# Altium project PCB_Project_Perdolyot.PrjPcb
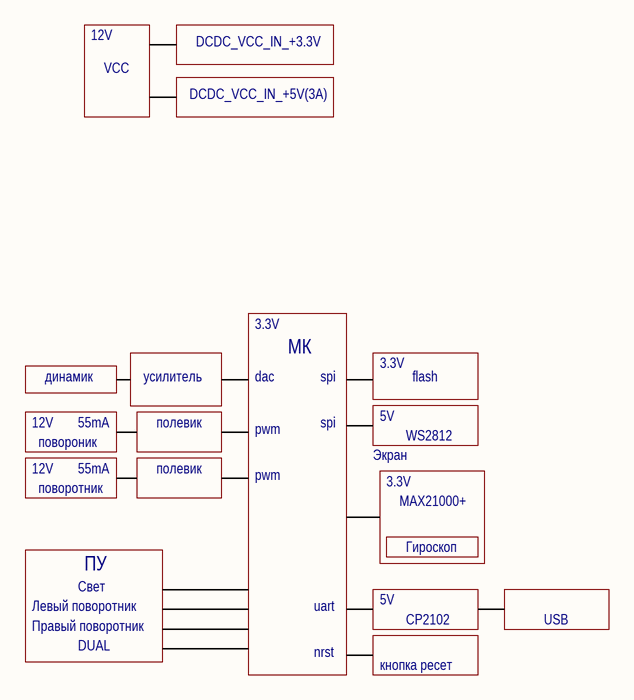
[diagram p0: ТЗ.SchDoc]
10 sheets, 56 parts. Net scope: flat (ports and power ports of the same name join across sheets).
Board file: PCB1.PcbDoc
Sheets:
  ТЗ.SchDoc
  Схема_узел_поворотников.SchDoc
  Схема_узел_подключения светодиодной ленты.SchDoc
  Flash.SchDoc
  DC-DC_VCC_IN_+3V.SchDoc
  Sheet1.SchDoc
  Узел UART преобразователя.SchDoc
  Узел разъёма usb.SchDoc
  Узел входного разъёма питания.SchDoc
  Микроконтроллер.SchDoc

## Sheet ТЗ.SchDoc
size A4

### Notes on the sheet
- 12V
- VCC
- DCDC_VCC_IN_+3.3V
- DCDC_VCC_IN_+5V(3A)
- динамик
- усилитель
- dac
- 3.3V
- МК
- spi
- flash
- повороник
- поворотник
- 55mA
- полевик
- pwm
- Экран
- 5V
- WS2812
- ПУ
- MAX21000+
- Гироскоп
- Левый поворотник
- Правый поворотник
- DUAL
- Свет
- uart
- nrst
- CP2102
- USB
- кнопка ресет

## Sheet Схема_узел_поворотников.SchDoc: we
size A4; ApprovedBy: wdwd; CheckedBy: 1; Author: 2; CompanyName: 3; DrawnBy: 4; Engineer: 5; Organization: 6; Address1: 7; Address2: 8; Address3: 9; Address4: 0
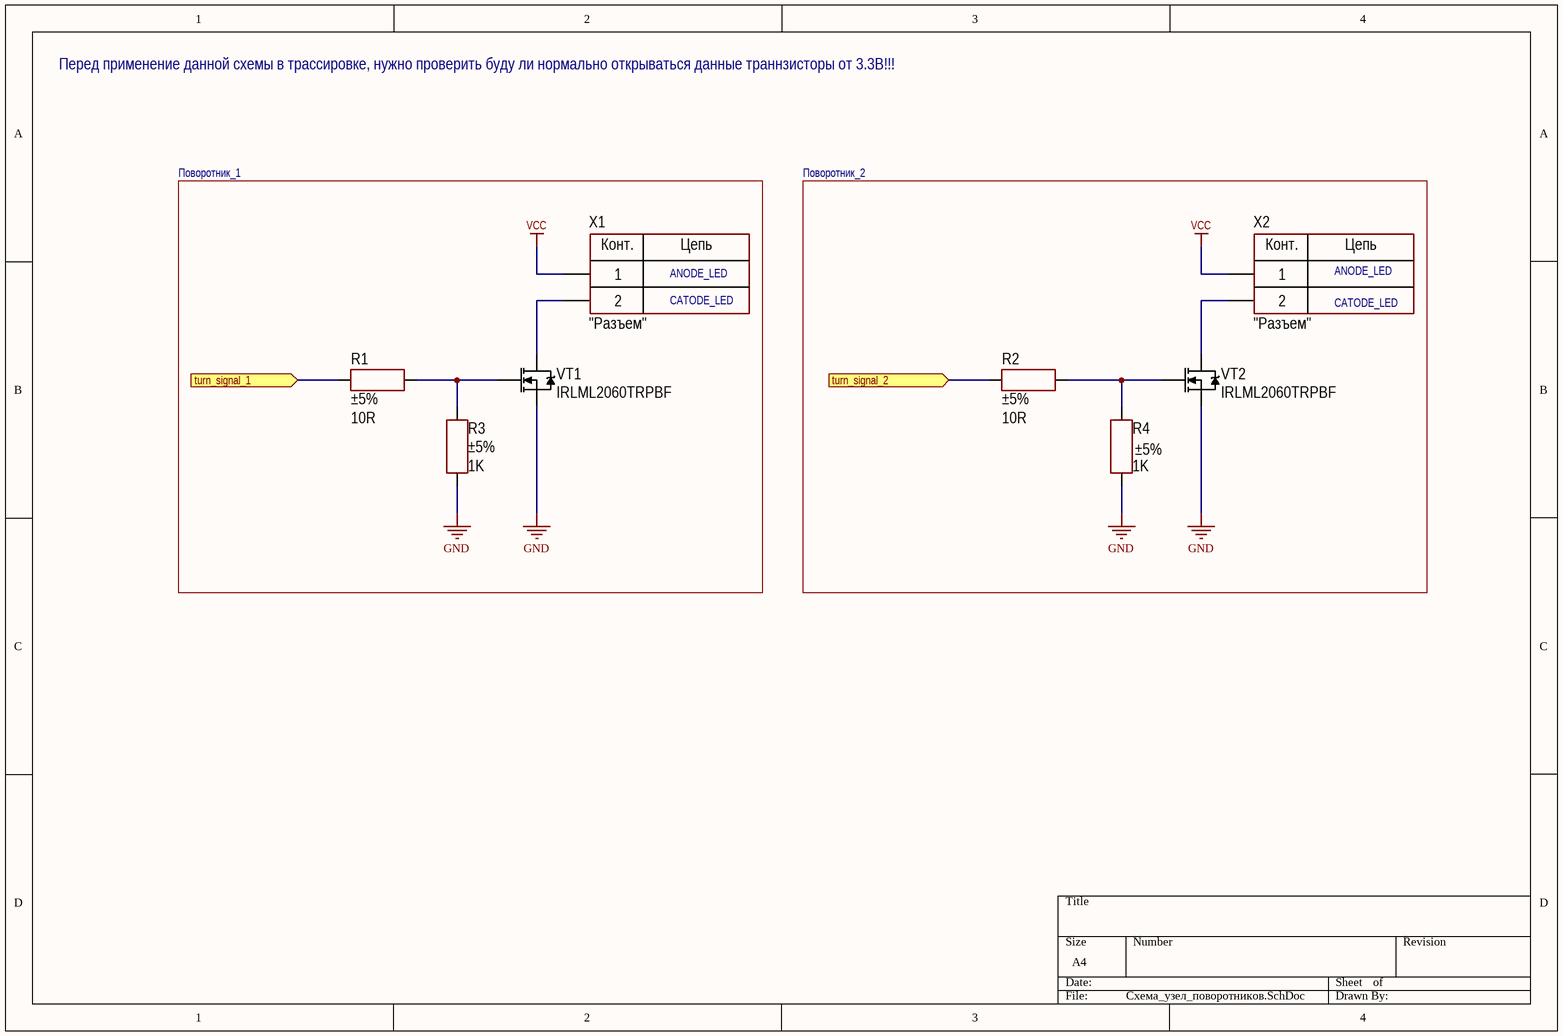
[diagram p1: Схема_узел_поворотников.SchDoc]

### Parts
R1  value 10R  Tolerance: ±5%  [RES: 0603]
R2  value 10R  Tolerance: ±5%  [RES: 0603]
R3  value 1K  Tolerance: ±5%  [RES: 0603]
R4  value 1K  Tolerance: ±5%  [RES: 0603]
VT1  PartNumber: IRLML2060TRPBF  [SOT23]
VT2  PartNumber: IRLML2060TRPBF  [SOT23]
X1  CommentText: "Разъем"  [CON: DG350-3.5-02P]
X2  CommentText: "Разъем"  [CON: DG350-3.5-02P]

### Ports
turn_signal_1 (in), turn_signal_2 (in)

### Nets
GND: R3.1 R4.1 VT1.2(S) VT2.2(S)
VCC: X1.1 X2.1
NetD6_12: R1.1 ; port turn_signal_1
NetD6_13: R2.1 ; port turn_signal_2
NetR1_2: R1.2 R3.2 VT1.1(G)
NetR2_2: R2.2 R4.2 VT2.1(G)
NetVT1_3: VT1.3(D) X1.2
NetVT2_3: VT2.3(D) X2.2

### Notes on the sheet
- Перед применение данной схемы в трассировке, нужно проверить буду ли нормально открываться данные траннзисторы от 3.3В!!!
- Поворотник_1
- Поворотник_2
- ANODE_LED
- CATODE_LED
- (in symbol Connector_terminal_2pin) Конт.; Цепь

### Library data of the parts
R1 R2 = Resistor_0603: Manufacturer: Yageo; PartNumber: RC0603JR-07100RL; ValueManufacturerPartNumber: Resistor film, 10R, ±5%, 0603, 0.1W, -55...+125°C; TypeResistor: Resistor film; Power: 0.1W; Package: 0603; HelpURL: https://www.digikey.com/product-detail/en/yageo/RC0603JR-07100RL/311-100GRCT-ND/729644; Temperature: -55...+125°C
R3 R4 = Resistor_0603: Manufacturer: Yageo; PartNumber: RC0603JR-07100RL; ValueManufacturerPartNumber: Resistor film, 1K, ±5%, 0603, 0.1W, -55...+125°C; TypeResistor: Resistor film; Power: 0.1W; Package: 0603; HelpURL: https://www.digikey.com/product-detail/en/yageo/RC0603JR-07100RL/311-100GRCT-ND/729644; Temperature: -55...+125°C
VT1 VT2 = MOSFET_N_132: Manufacturer: Infineon Technologies; ValueManufacturerPartNumber: MOSFET N-channel transistor, 80V, 7A, 9.1nC, 2.5W, 34mOhm, 756pF, 8-TDSON, -55...+150°C; TypeTransistor: MOSFET N-channel transistor; VoltageDS: 80V; CurrentDS: 7A; RDS: 34mOhm; GateCharge: 9.1nC; InputCapacitor: 756pF; MaxPower: 2.5W; Package: 8-TDSON; HelpURL: https://www.digikey.com/product-detail/en/infineon-technologies/BSC340N08NS3GATMA1/BSC340N08NS3GATMA1TR-ND/2080655; Temperature: -55...+150°C
X1 X2 = Connector_terminal_2pin: Manufacturer: Degson; ValueManufacturerPartNumber: Terminal connector, 2pin, 3.5mm, 300VAC, 10A; PartNumber: DG350-3.5-02P-14; TypeConnector: Terminal connector; VoltageMax: 300VAC; Pitch: 3.5mm; CurrentMax: 10A; Multichannel: 2pin; HelpURL: https://www.chipdip.ru/product/dg350-3.5-02p-12

## Sheet Схема_узел_подключения светодиодной ленты.SchDoc
size A4
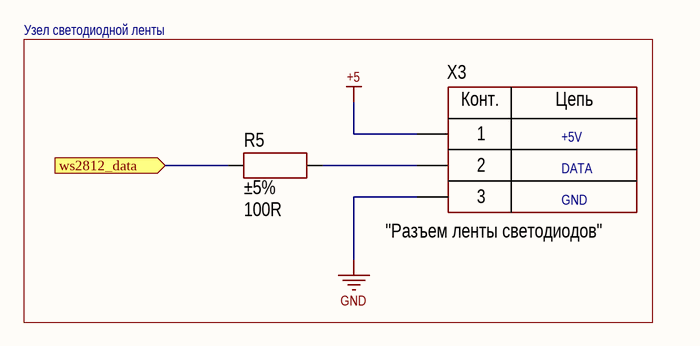
[diagram p2: Схема_узел_подключения светодиодной ленты.SchDoc]

### Parts
R5  value 100R  Tolerance: ±5%  [RES: 0603]
X3  CommentText: "Разъем ленты светодиодов"  [CON: DG350-3.5-03P]

### Ports
ws2812_data (in)

### Nets
+5: X3.1
GND: X3.3
NetD6_8: R5.1 ; port ws2812_data
NetR5_2: R5.2 X3.2

### Notes on the sheet
- Узел светодиодной ленты
- GND
- DATA
- +5V
- (in symbol Connector_terminal_3pin) Конт.; Цепь

### Library data of the parts
R5 = Resistor_0603: Manufacturer: Yageo; PartNumber: RC0603JR-07100RL; ValueManufacturerPartNumber: Resistor film, 100R, ±5%, 0603, 0.1W, -55...+125°C; TypeResistor: Resistor film; Power: 0.1W; Package: 0603; HelpURL: https://www.digikey.com/product-detail/en/yageo/RC0603JR-07100RL/311-100GRCT-ND/729644; Temperature: -55...+125°C
X3 = Connector_terminal_3pin: Manufacturer: Degson; ValueManufacturerPartNumber: Terminal connector, 3pin, 3.5mm, 300VAC, 10A; PartNumber: DG350-3.5-03P-14; TypeConnector: Terminal connector; VoltageMax: 300VAC; Pitch: 3.5mm; CurrentMax: 10A; Multichannel: 3pin; HelpURL: https://www.chipdip.ru/product/dg350-3.5-03p-12

## Sheet Flash.SchDoc
size A4
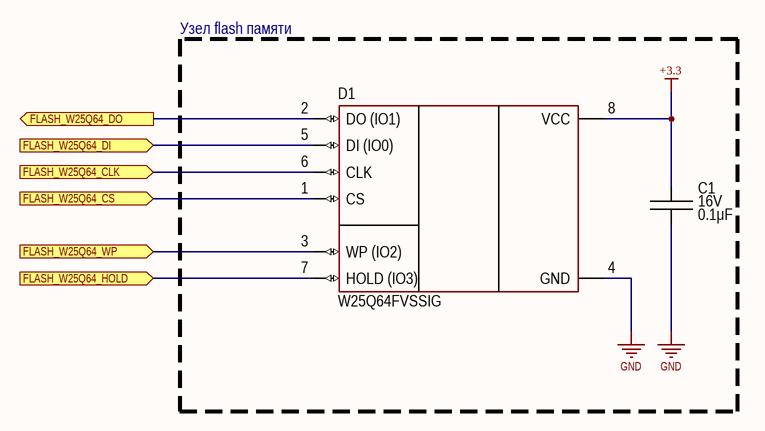
[diagram p3: Flash.SchDoc]

### Parts
C1  value 0.1μF  Voltage: 16V  [CAP: 0603]
D1  (no value)  [8-SOIC]

### Blocks framed on the sheet
Узел flash памяти: C1 D1

### Ports
FLASH_W25Q64_CLK (in), FLASH_W25Q64_CS (in), FLASH_W25Q64_DI (in), FLASH_W25Q64_DO (out), FLASH_W25Q64_HOLD (in), FLASH_W25Q64_WP (in)

### Nets
+3.3: C1.1 D1.8(VCC)
GND: C1.2 D1.4(GND)
NetD1_1: D1.1(CS) ; port FLASH_W25Q64_CS
NetD1_2: D1.2(DO_(IO1)) ; port FLASH_W25Q64_DO
NetD1_3: D1.3(WP_(IO2)) ; port FLASH_W25Q64_WP
NetD1_5: D1.5(DI_(IO0)) ; port FLASH_W25Q64_DI
NetD1_6: D1.6(CLK) ; port FLASH_W25Q64_CLK
NetD1_7: D1.7(HOLD_(IO3)) ; port FLASH_W25Q64_HOLD

### Library data of the parts
C1 = Ceramic_0603: Manufacturer: Yageo; PartNumber: CC0603KRX7R7BB104; ValueManufacturerPartNumber: Ceramic capacitor, 0.1μF, X7R, ±10%, 16V, 0603, -55...+125°C; TypeCapacitor: Ceramic capacitor; Tolerance: ±10%; TypeDielectric: X7R; Package: 0603; HelpURL: https://www.digikey.com/product-detail/en/yageo/CC0603KRX7R7BB104/311-1088-1-ND/302998; Temperature: -55...+125°C
D1 = W25Q64FVSSIG: FLASH; Manufacturer: Winbond Electronics; ValueManufacturerPartNumber: IC memory, FLASH, 64Mb (8M x 8), 104 MHz, SPI/QuadSPI, 2.7...3.6V, -40...+85°C, 8-SOIC; Supply: 2.7...3.6V; Speed: 104 MHz; InterfaceData: SPI/QuadSPI; MemorySize: 64Mb (8M x 8); HelpURL: https://www.chipdip.by/product/w25q64fvssig-25q64fvsig; Package: 8-SOIC; ComponentType: IC memory; Temperature: -40...+85°C; MemoryType: FLASH; PartNumber: W25Q64FVSSIG

## Sheet DC-DC_VCC_IN_+3V.SchDoc
size A4
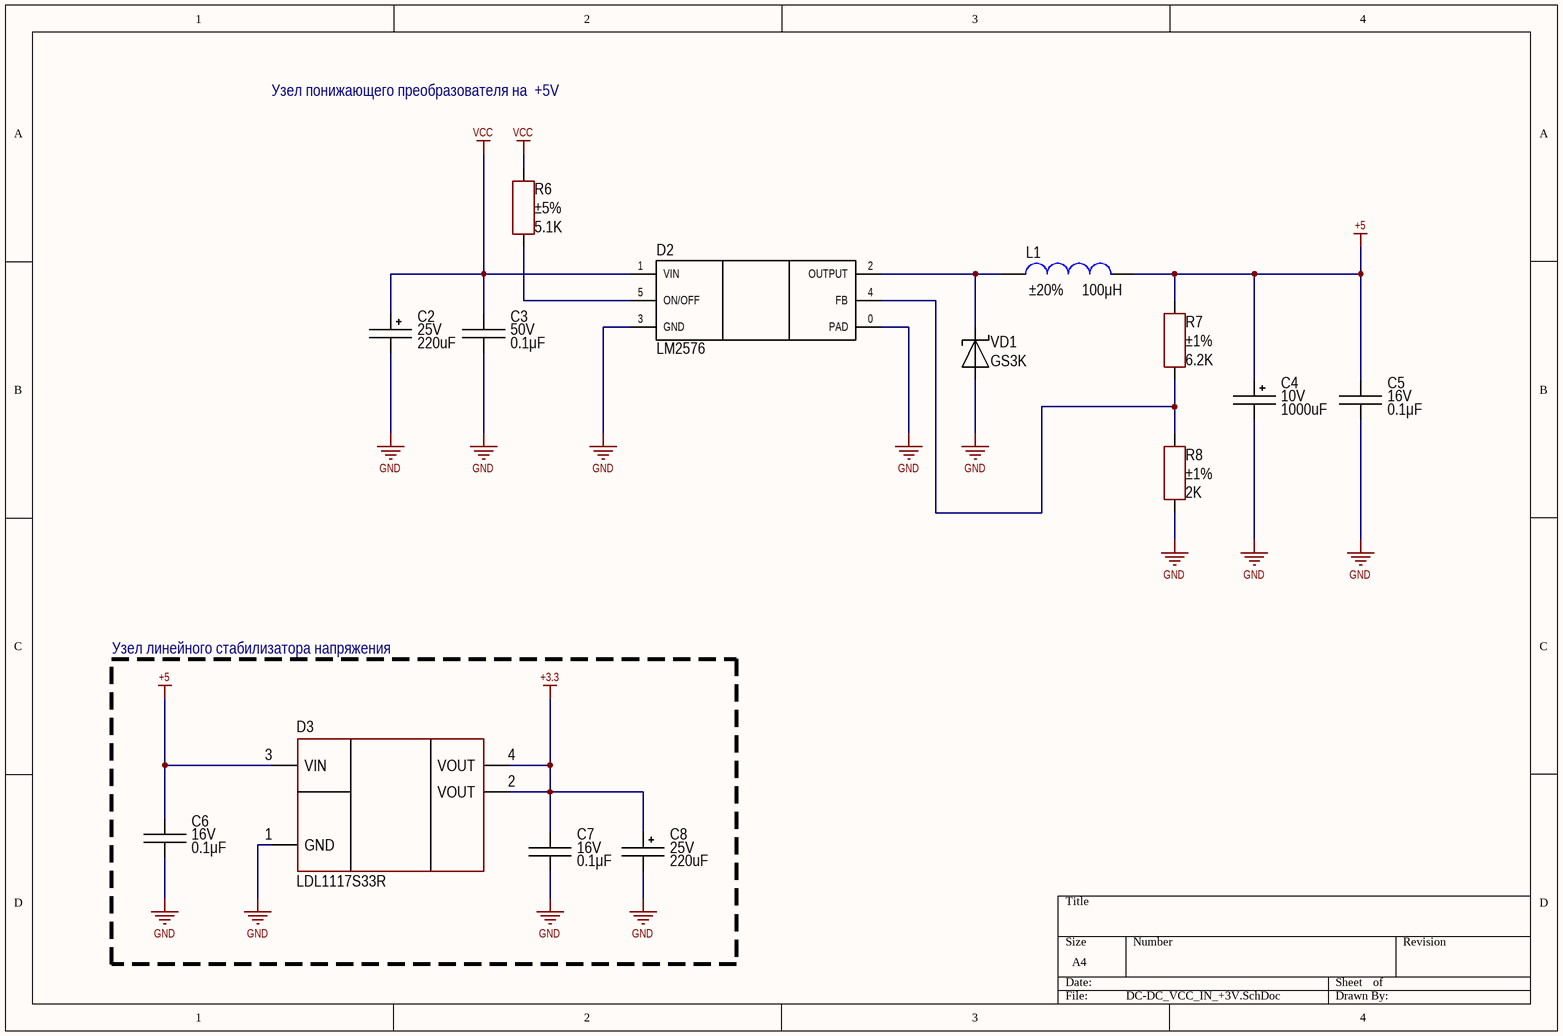
[diagram p4: DC-DC_VCC_IN_+3V.SchDoc]

### Parts
C2  value 220uF  Voltage: 25V  [CAP: D6.3C2.5H11]
C3  value 0.1μF  Voltage: 50V  [CAP: 0603]
C4  value 1000uF  Voltage: 10V  [CAP: D8C3.5H12]
C5  value 0.1μF  Voltage: 16V  [CAP: 0603]
C6  value 0.1μF  Voltage: 16V  [CAP: 0603]
C7  value 0.1μF  Voltage: 16V  [CAP: 0603]
C8  value 220uF  Voltage: 25V  [CAP: D6.3C2.5H11]
D2  (no value)  [TO-220-5]
D3  (no value)  [SOT223]
L1  value 100μH  Tolerance: ±20%  [CDRH]
R6  value 5.1K  Tolerance: ±5%  [RES: 0603]
R7  value 6.2K  Tolerance: ±1%  [RES: 0603]
R8  value 2K  Tolerance: ±1%  [RES: 0603]
VD1  PartNumber: GS3K  [DIODE: SMC]

### Blocks framed on the sheet
Узел линейного стабилизатора напряжения: C6-C8 D3

### Nets
+3.3: C7.2 C8.1 D3.2(VOUT) D3.4(VOUT)
+5: C4.1 C5.2 C6.2 D3.3(VIN) L1.1 R7.2
GND: C2.2 C3.1 C4.2 C5.1 C6.1 C7.1 C8.2 D2.0(PAD) D2.3(GND) D3.1(GND) R8.1 VD1.1
VCC: C2.1 C3.2 D2.1(VIN) R6.2
NetD2_2: D2.2(OUTPUT) L1.2 VD1.2
NetD2_4: D2.4(FB) R7.1 R8.2
NetD2_5: D2.5(ON/OFF) R6.1

### Notes on the sheet
- Узел понижающего преобразователя на  +5V

### Library data of the parts
C2 C8 = Aluminium: Manufacturer: Aishi; PartNumber: 42330; ValueManufacturerPartNumber: Aluminium capacitor, 220uF, 25V, ±20%, 54mOhm, 6.3x12, -55...+105°C; TypeCapacitor: Aluminium capacitor; Tolerance: ±20%; Impedance: 54mOhm; Package: 6.3x12; HelpURL: https://belchip.by/product/?selected_product=42330; Temperature: -55...+105°C
C3 = Ceramic_0603: Manufacturer: Yageo; PartNumber: CC0603KRX7R7BB104; ValueManufacturerPartNumber: Ceramic capacitor, 0.1μF, X7R, ±10%, 50V, 0603, -55...+125°C; TypeCapacitor: Ceramic capacitor; Tolerance: ±10%; TypeDielectric: X7R; Package: 0603; HelpURL: https://www.digikey.com/product-detail/en/yageo/CC0603KRX7R7BB104/311-1088-1-ND/302998; Temperature: -55...+125°C
C4 = Aluminium: Manufacturer: Aishi; PartNumber: 01675; ValueManufacturerPartNumber: Aluminium capacitor, 1000uF, 10V, ±20%, 54mOhm, 8x12, -55...+105°C; TypeCapacitor: Aluminium capacitor; Tolerance: ±20%; Impedance: 54mOhm; Package: 8x12; HelpURL: https://belchip.by/product/?selected_product=01675; Temperature: -55...+105°C
C5-C7 = Ceramic_0603: as C1 on sheet Flash; Package: 0603; HelpURL: https://www.digikey.com/product-detail/en/yageo/CC0603KRX7R7BB104/311-1088-1-ND/302998; Temperature: -55...+125°C
D2 = LM2576: Step-Down Voltage Regulator; Manufacturer: texas instruments; ValueManufacturerPartNumber: Step-Down Voltage Regulator, 7-40V, 52kHz, 1.23V to 37V, 3A, -40...+125°C, TO-220; VoltageInput: 7-40V; Frequency: 52kHz; CurrentOutput: 3A; VoltageOutput: 1.23V to 37V; HelpURL: https://www.ti.com/lit/ds/symlink/lm2576.pdf?ts=1627791238986&ref_url=https%253A%252F%252Fwww.google.com%252F; Package: TO-220; ComponentType: Step-Down Voltage Regulator; Temperature: -40...+125°C; PartNumber: LM2576
D3 = LDL1117S33R: Linear voltage regulator; Manufacturer: STMicroelectronics; ValueManufacturerPartNumber: Linear voltage regulator, input 3.9...18V, 0.6V, output 3.3V, 1.2A, -40...+85°C, SOT223; VoltageInput: input 3.9...18V; MaxDropout: 0.6V; CurrentOutput: 1.2A; VoltageOutput: output 3.3V; HelpURL: https://www.digikey.com/product-detail/en/stmicroelectronics/LDL1117S33R/497-17239-1-ND/7102079; Package: SOT223; ComponentType: Linear voltage regulator; Temperature: -40...+85°C; PartNumber: LDL1117S33R
L1 = Inductor_CDRH: Manufacturer: Bourns; ValueManufacturerPartNumber: Fixed inductor, 100μH, ±20%, CDRH101R, 3A, -40...+150°C; TypeInductor: Fixed inductor; MaxCurrent: 3A; PartNumber: CDRH; Package: CDRH101R; HelpURL: https://aliexpress.ru/item/32956142172.html?spm=a2g0s.9042311.0.0.f06533edih9Buf; Temperature: -40...+150°C
R6 = Resistor_0603: Manufacturer: Yageo; PartNumber: RC0603JR-07100RL; ValueManufacturerPartNumber: Resistor film, 5.1K, ±5%, 0603, 0.1W, -55...+125°C; TypeResistor: Resistor film; Power: 0.1W; Package: 0603; HelpURL: https://www.digikey.com/product-detail/en/yageo/RC0603JR-07100RL/311-100GRCT-ND/729644; Temperature: -55...+125°C
R7 = Resistor_0603: Manufacturer: Yageo; PartNumber: RC0603JR-07100RL; ValueManufacturerPartNumber: Resistor film, 6.2K, ±1%, 0603, 0.1W, -55...+125°C; TypeResistor: Resistor film; Power: 0.1W; Package: 0603; HelpURL: https://www.digikey.com/product-detail/en/yageo/RC0603JR-07100RL/311-100GRCT-ND/729644; Temperature: -55...+125°C
R8 = Resistor_0603: Manufacturer: Yageo; PartNumber: RC0603JR-07100RL; ValueManufacturerPartNumber: Resistor film, 2K, ±1%, 0603, 0.1W, -55...+125°C; TypeResistor: Resistor film; Power: 0.1W; Package: 0603; HelpURL: https://www.digikey.com/product-detail/en/yageo/RC0603JR-07100RL/311-100GRCT-ND/729644; Temperature: -55...+125°C
VD1 = Schottky_single: Manufacturer: Yangzhou Yangjie Electronic Technology Co., Ltd.; ValueManufacturerPartNumber: Schottky diode, 800V, 3A, 1.15V, 15pF, DO-214AB / SMC, -55...+150°C; TypeDiode: Schottky diode; Voltage: 800V; Current: 3A; VoltageDrop: 1.15V; RecoveryTime: 15pF; Package: DO-214AB / SMC; HelpURL: https://www.chipdip.by/product/gs3k; Temperature: -55...+150°C

## Sheet Sheet1.SchDoc
size A3
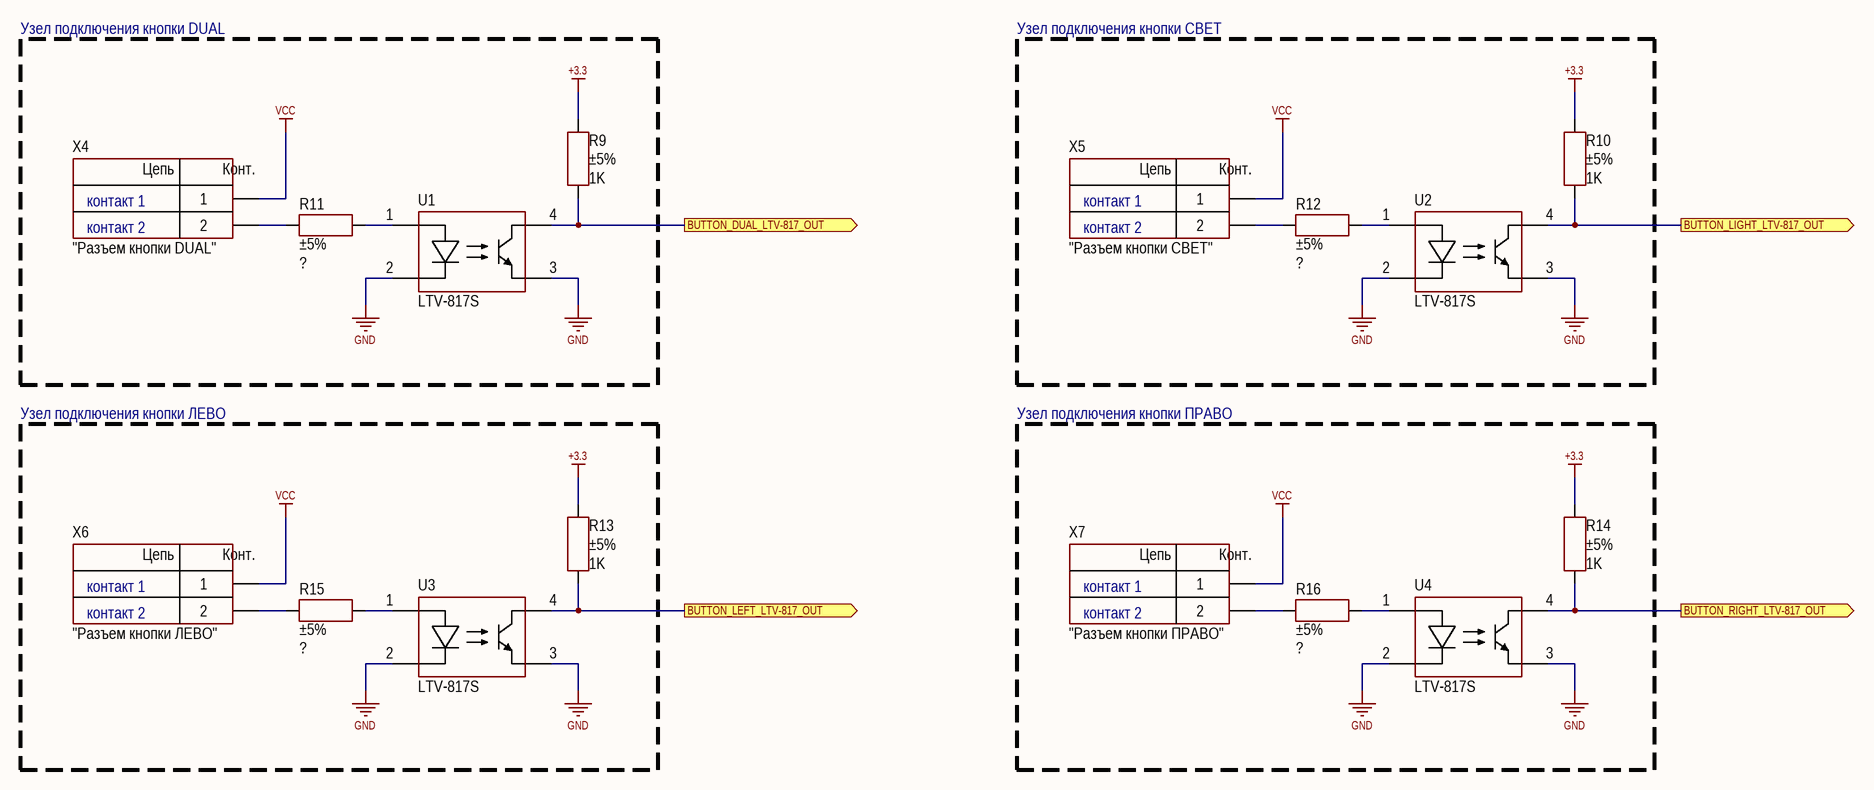
[diagram p5: Sheet1.SchDoc]

### Parts
R9  value 1K  Tolerance: ±5%  [RES: 0603]
R10  value 1K  Tolerance: ±5%  [RES: 0603]
R11  Tolerance: ±5%  [RES: 0603]
R12  Tolerance: ±5%  [RES: 0603]
R13  value 1K  Tolerance: ±5%  [RES: 0603]
R14  value 1K  Tolerance: ±5%  [RES: 0603]
R15  Tolerance: ±5%  [RES: 0603]
R16  Tolerance: ±5%  [RES: 0603]
U1  PartNumber: LTV-817S  [4-SMD]
U2  PartNumber: LTV-817S  [4-SMD]
U3  PartNumber: LTV-817S  [4-SMD]
U4  PartNumber: LTV-817S  [4-SMD]
X4  CommentText: "Разъем кнопки DUAL"  [CON: DG350-3.5-02P]
X5  CommentText: "Разъем кнопки СВЕТ"  [CON: DG350-3.5-02P]
X6  CommentText: "Разъем кнопки ЛЕВО"  [CON: DG350-3.5-02P]
X7  CommentText: "Разъем кнопки ПРАВО"  [CON: DG350-3.5-02P]

### Ports
BUTTON_DUAL_LTV-817_OUT (out), BUTTON_LEFT_LTV-817_OUT (out), BUTTON_LIGHT_LTV-817_OUT (out), BUTTON_RIGHT_LTV-817_OUT (out)

### Nets
+3.3: R9.2 R10.2 R13.2 R14.2
GND: U1.2(C) U1.3(E) U2.2(C) U2.3(E) U3.2(C) U3.3(E) U4.2(C) U4.3(E)
VCC: X4.1 X5.1 X6.1 X7.1
NetD6_16: R14.1 U4.4(C) ; port BUTTON_RIGHT_LTV-817_OUT
NetD6_18: R13.1 U3.4(C) ; port BUTTON_LEFT_LTV-817_OUT
NetD6_19: R9.1 U1.4(C) ; port BUTTON_DUAL_LTV-817_OUT
NetD6_22: R10.1 U2.4(C) ; port BUTTON_LIGHT_LTV-817_OUT
NetR11_1: R11.1 X4.2
NetR11_2: R11.2 U1.1(A)
NetR12_1: R12.1 X5.2
NetR12_2: R12.2 U2.1(A)
NetR15_1: R15.1 X6.2
NetR15_2: R15.2 U3.1(A)
NetR16_1: R16.1 X7.2
NetR16_2: R16.2 U4.1(A)

### Notes on the sheet
- Узел подключения кнопки DUAL
- Узел подключения кнопки СВЕТ
- контакт 1
- контакт 2
- Узел подключения кнопки ЛЕВО
- Узел подключения кнопки ПРАВО
- (in symbol Connector_terminal_2pin) Цепь; Конт.

### Library data of the parts
R9 R10 R13 R14 = Resistor_0603: as R3 on sheet Схема_узел_поворотников; Package: 0603; HelpURL: https://www.digikey.com/product-detail/en/yageo/RC0603JR-07100RL/311-100GRCT-ND/729644; Temperature: -55...+125°C
R11 R12 R15 R16 = Resistor_0603: Manufacturer: Yageo; PartNumber: RC0603JR-07100RL; ValueManufacturerPartNumber: Resistor film, ?, ±5%, 0603, 0.1W, -55...+125°C; TypeResistor: Resistor film; Power: 0.1W; Package: 0603; HelpURL: https://www.digikey.com/product-detail/en/yageo/RC0603JR-07100RL/311-100GRCT-ND/729644; Temperature: -55...+125°C; Value: ?
U1-U4 = LTV-817: Optoisolator; Manufacturer: Lite-On; ValueManufacturerPartNumber: IC optoisolator, 4µs/3µs, 5000Vrms, 35V, -40...+125°C, 4-SMD; Supply: 35V; DataRate: 4µs/3µs; Isolation: 5000Vrms; HelpURL: https://www.digikey.com/product-detail/en/lite-on-inc/LTV-817S/160-1367-5-ND/385837; Package: 4-SMD; ComponentType: IC optoisolator; Temperature: -40...+125°C
X4-X7 = Connector_terminal_2pin: as X1 on sheet Схема_узел_поворотников; HelpURL: https://www.chipdip.ru/product/dg350-3.5-02p-12

## Sheet Узел UART преобразователя.SchDoc
size 420 x 297 mm; Address1: Address1; Address2: Address2; Address3: Address3; Address4: Address4; DocumentNumber: АБВГ.123456.001 Э3; SheetNumber: 1; Scale: 1:1; DocumentType: Схема электрическая принципиальная; FirstReferrence: АБВГ.123456.001
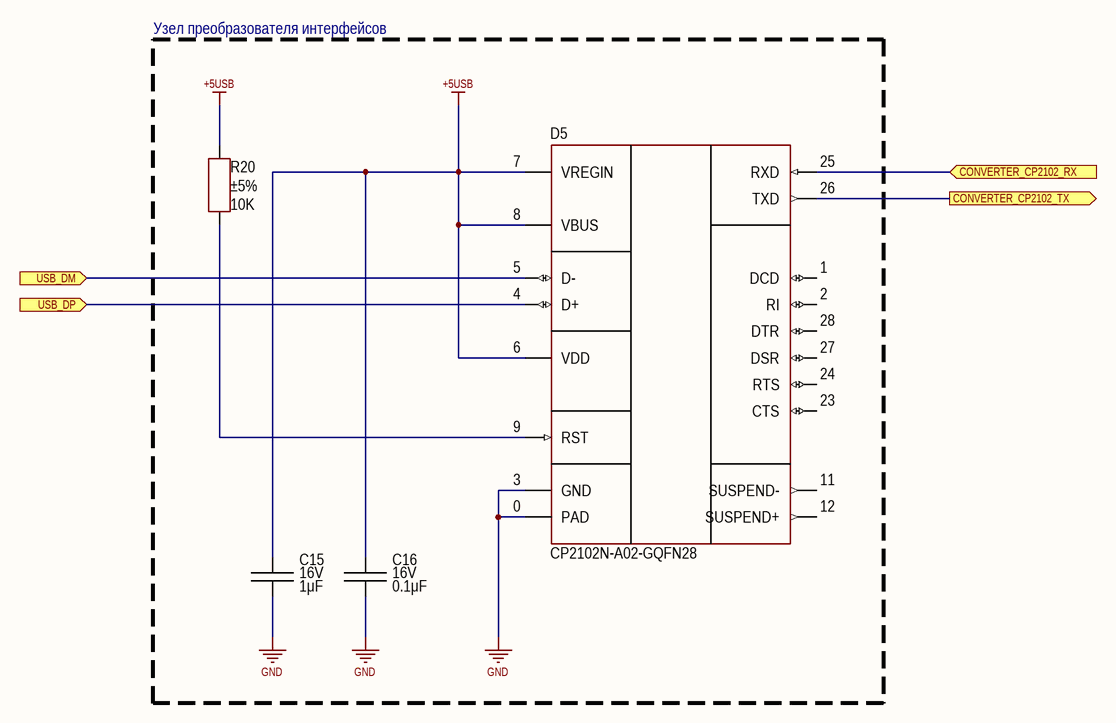
[diagram p6: Узел UART преобразователя.SchDoc]

### Parts
C15  value 1μF  Voltage: 16V  [CAP: 0603]
C16  value 0.1μF  Voltage: 16V  [CAP: 0603]
D5  PartNumber: CP2102N-A02-GQFN28  [28-QFN (5x5)]
R20  value 10K  Tolerance: ±5%  [RES: 0603]

### Blocks framed on the sheet
Узел преобразователя интерфейсов: C15 C16 D5 R20

### Ports
CONVERTER_CP2102_RX (in), CONVERTER_CP2102_TX (out), USB_DM (in), USB_DP (in)

### Nets
+5USB: C15.2 C16.2 D5.6(VDD) D5.7(VREGIN) D5.8(VBUS) R20.2
GND: C15.1 C16.1 D5.0(PAD) D5.3(GND)
NetD5_4: D5.4(D+) ; port USB_DP
NetD5_5: D5.5(D-) ; port USB_DM
NetD5_9: D5.9(RST) R20.1
NetD5_25: D5.25(RXD) ; port CONVERTER_CP2102_RX
NetD5_26: D5.26(TXD) ; port CONVERTER_CP2102_TX

Not connected (* = marked no-connect by the designer): D5 1(DCD) 2(RI) 11(SUSPEND-) 12(SUSPEND+) 23(CTS) 24(RTS) 27(DSR) 28(DTR)

### Notes on the sheet
- Перв. примен.
- Справ. №
- Подп. и дата
- Инв. № дубл.
- Взам. инв. №
- Разраб.
- Изм.
- Лист
- № докум.
- Подп.
- Дата
- Лит.
- Масса
- Масштаб
- Пров.
- Т.контр.
- Листов
- Инв. № подл.
- Утв.
- Н.контр.
- 2.106-A3
- Копировал
- Формат А3

### Library data of the parts
C15 = Ceramic_0603: Manufacturer: Yageo; PartNumber: CC0603KRX7R7BB104; ValueManufacturerPartNumber: Ceramic capacitor, 1μF, X7R, ±10%, 16V, 0603, -55...+125°C; TypeCapacitor: Ceramic capacitor; Tolerance: ±10%; TypeDielectric: X7R; Package: 0603; HelpURL: https://www.digikey.com/product-detail/en/yageo/CC0603KRX7R7BB104/311-1088-1-ND/302998; Temperature: -55...+125°C
C16 = Ceramic_0603: as C1 on sheet Flash; Package: 0603; HelpURL: https://www.digikey.com/product-detail/en/yageo/CC0603KRX7R7BB104/311-1088-1-ND/302998; Temperature: -55...+125°C
D5 = CP2102N: USB-to-UART; Manufacturer: Silicon Labs; ValueManufacturerPartNumber: IC usb-to-uart bridge, USB2.0, 3...3.6V, -40...+85°C, 28-VFQFN; Supply: 3...3.6V; HelpURL: https://www.digikey.com/product-detail/en/silicon-labs/CP2102N-A02-GQFN28/336-5889-ND/9863477; Package: 28-VFQFN; ComponentType: IC usb-to-uart bridge; Temperature: -40...+85°C; Standard: USB2.0
R20 = Resistor_0603: Manufacturer: Yageo; PartNumber: RC0603JR-07100RL; ValueManufacturerPartNumber: Resistor film, 10K, ±5%, 0603, 0.1W, -55...+125°C; TypeResistor: Resistor film; Power: 0.1W; Package: 0603; HelpURL: https://www.digikey.com/product-detail/en/yageo/RC0603JR-07100RL/311-100GRCT-ND/729644; Temperature: -55...+125°C

## Sheet Узел разъёма usb.SchDoc
size A4; Address1: Address1; Address2: Address2; Address3: Address3; Address4: Address4; DocumentNumber: АБВГ.123456.001 Э3; SheetNumber: 1; Scale: 1:1; DocumentType: Схема электрическая принципиальная; FirstReferrence: АБВГ.123456.001
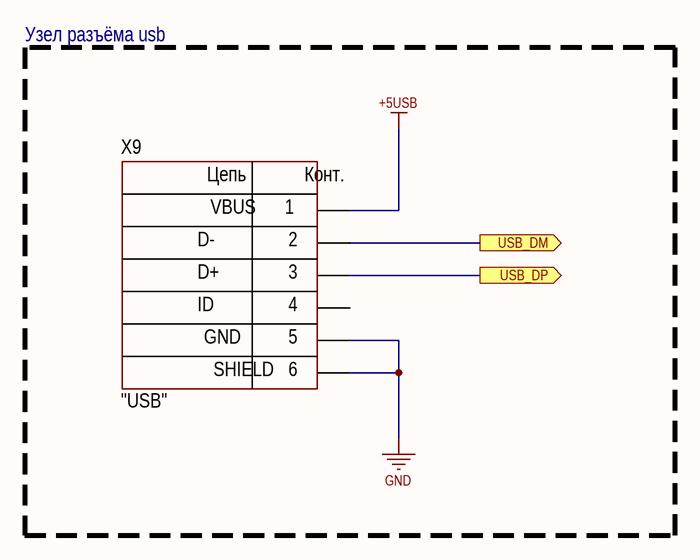
[diagram p7: Узел разъёма usb.SchDoc]

### Parts
X9  CommentText: "USB"  [CON: USB micro-A (ZX62-B-5PA)]

### Blocks framed on the sheet
Узел разъёма usb: X9

### Ports
USB_DM (out), USB_DP (out)

### Nets
+5USB: X9.1
GND: X9.0 X9.5
NetD5_4: X9.3 ; port USB_DP
NetD5_5: X9.2 ; port USB_DM

Not connected (* = marked no-connect by the designer): X9 4

### Notes on the sheet
- Title
- Size:
- Date:
- A4
- Number:
- Time:
- Revision:
- Sheet
- of
- File:
- (in symbol Connector_USB_micro_B) Цепь; Конт.; VBUS; D-; D+; ID; GND; SHIELD; 6

### Library data of the parts
X9 = Connector_USB_micro_B: Manufacturer: Hirose Electric; ValueManufacturerPartNumber: USB micro B; PartNumber: ZX62-B-5PA; HelpURL: https://www.digikey.com/product-detail/en/hirose-electric-co-ltd/ZX62-B-5PA/H11579CT-ND/1851090; TypeConnector: USB micro B

## Sheet Узел входного разъёма питания.SchDoc
size 420 x 297 mm; Address1: Address1; Address2: Address2; Address3: Address3; Address4: Address4; DocumentNumber: АБВГ.123456.001 Э3; SheetNumber: 1; Scale: 1:1; DocumentType: Схема электрическая принципиальная; FirstReferrence: АБВГ.123456.001
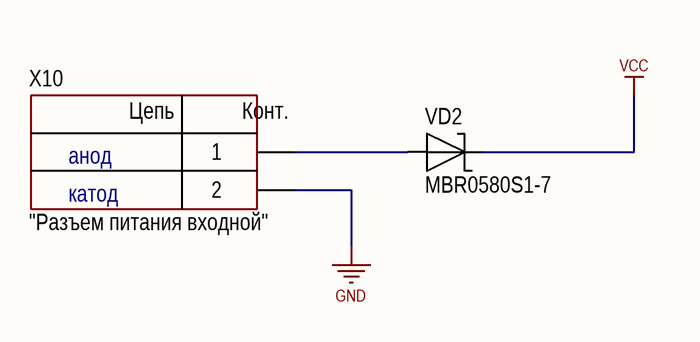
[diagram p8: Узел входного разъёма питания.SchDoc]

### Parts
VD2  PartNumber: MBR0580S1-7  [DIODE: SMC]
X10  CommentText: "Разъем питания входной"  [CON: DG350-3.5-02P]

### Nets
GND: X10.2
VCC: VD2.2
NetVD2_1: VD2.1 X10.1

### Notes on the sheet
- анод
- катод
- Перв. примен.
- Справ. №
- Подп. и дата
- Инв. № дубл.
- Взам. инв. №
- Разраб.
- Изм.
- Лист
- № докум.
- Подп.
- Дата
- Лит.
- Масса
- Масштаб
- Пров.
- Т.контр.
- Листов
- Инв. № подл.
- Утв.
- Н.контр.
- 2.106-A3
- Копировал
- Формат А3
- (in symbol Connector_terminal_2pin) Цепь; Конт.

### Library data of the parts
VD2 = Schottky_single: Manufacturer: Diodes Incorporated; ValueManufacturerPartNumber: Schottky diode, 80V, 500mA, 1V, 15pF, SOD-123, -55...+150°C; TypeDiode: Schottky diode; Voltage: 80V; Current: 500mA; VoltageDrop: 1V; RecoveryTime: 15pF; Package: SOD-123; HelpURL: https://www.digikey.com/product-detail/en/diodes-incorporated/MBR0580S1-7/MBR0580S1-7DICT-ND/5080371; Temperature: -55...+150°C
X10 = Connector_terminal_2pin: as X1 on sheet Схема_узел_поворотников; HelpURL: https://www.chipdip.ru/product/dg350-3.5-02p-12

## Sheet Микроконтроллер.SchDoc
size 420 x 297 mm; Address1: Address1; Address2: Address2; Address3: Address3; Address4: Address4; DocumentNumber: АБВГ.123456.001 Э3; SheetNumber: 1; Scale: 1:1; DocumentType: Схема электрическая принципиальная; FirstReferrence: АБВГ.123456.001
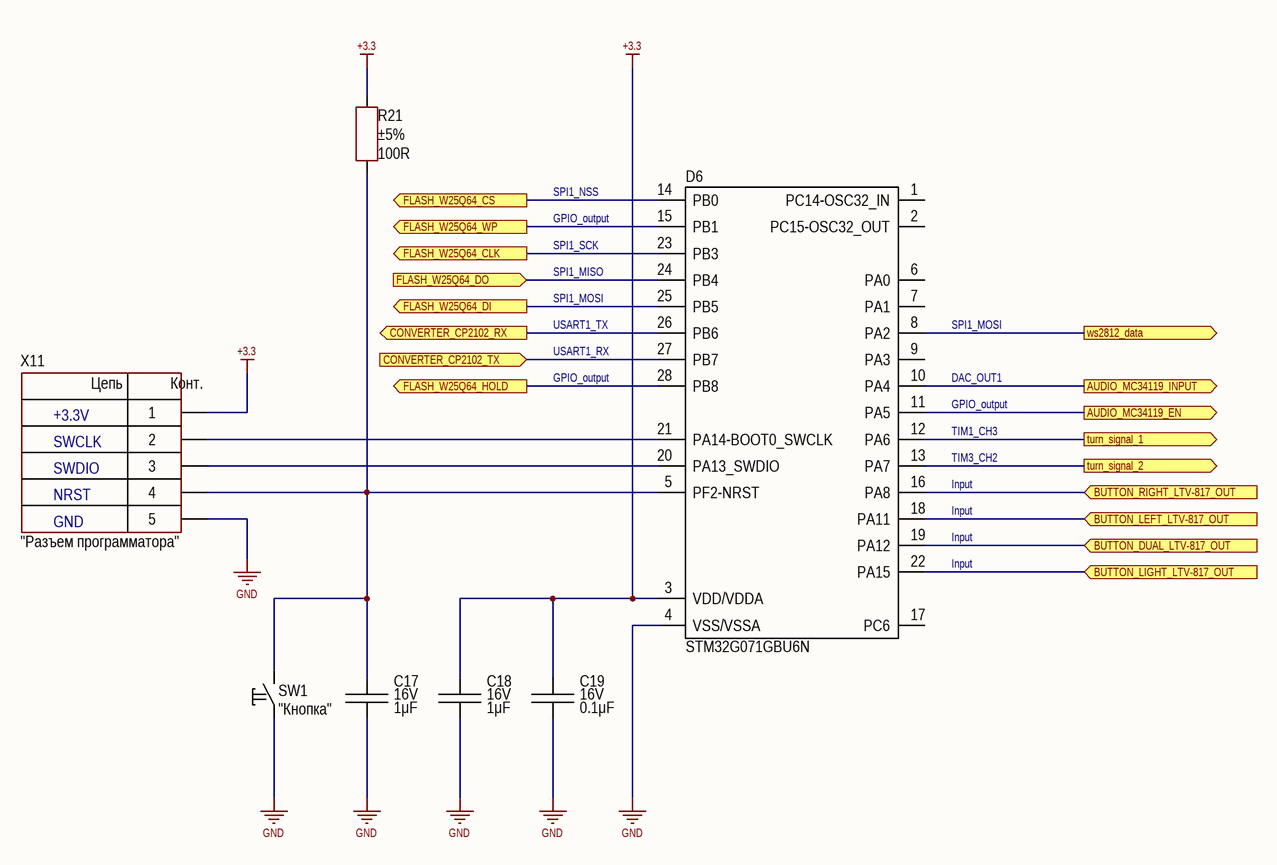
[diagram p9: Микроконтроллер.SchDoc]

### Parts
C17  value 1μF  Voltage: 16V  [CAP: 0603]
C18  value 1μF  Voltage: 16V  [CAP: 0603]
C19  value 0.1μF  Voltage: 16V  [CAP: 0603]
D6  (no value)  [28-UFQFPN]
R21  value 100R  Tolerance: ±5%  [RES: 0603]
SW1  CommentText: "Кнопка"  [BUT: 3x4x2 SMT]
X11  CommentText: "Разъем программатора"  [CON: PLS-5]

### Ports
AUDIO_MC34119_EN (out), AUDIO_MC34119_INPUT (out), BUTTON_DUAL_LTV-817_OUT (in), BUTTON_LEFT_LTV-817_OUT (in), BUTTON_LIGHT_LTV-817_OUT (in), BUTTON_RIGHT_LTV-817_OUT (in), CONVERTER_CP2102_RX (out), CONVERTER_CP2102_TX (in), FLASH_W25Q64_CLK (out), FLASH_W25Q64_CS (out), FLASH_W25Q64_DI (out), FLASH_W25Q64_DO (in), FLASH_W25Q64_HOLD (out), FLASH_W25Q64_WP (out), turn_signal_1 (out), turn_signal_2 (out), ws2812_data (out)

### Nets
+3.3: C18.2 C19.2 D6.3(VDD/VDDA) R21.2 X11.1
GND: C17.1 C18.1 C19.1 D6.4(VSS/VSSA) SW1.1 X11.5
NetC17_2: C17.2 D6.5(PF2-NRST) R21.1 SW1.2 X11.4
NetD1_1: D6.14(PB0) ; port FLASH_W25Q64_CS
NetD1_2: D6.24(PB4) ; port FLASH_W25Q64_DO
NetD1_3: D6.15(PB1) ; port FLASH_W25Q64_WP
NetD1_5: D6.25(PB5) ; port FLASH_W25Q64_DI
NetD1_6: D6.23(PB3) ; port FLASH_W25Q64_CLK
NetD1_7: D6.28(PB8) ; port FLASH_W25Q64_HOLD
NetD5_25: D6.26(PB6) ; port CONVERTER_CP2102_RX
NetD5_26: D6.27(PB7) ; port CONVERTER_CP2102_TX
NetD6_8: D6.8(PA2) ; port ws2812_data
NetD6_10: D6.10(PA4) ; port AUDIO_MC34119_INPUT
NetD6_11: D6.11(PA5) ; port AUDIO_MC34119_EN
NetD6_12: D6.12(PA6) ; port turn_signal_1
NetD6_13: D6.13(PA7) ; port turn_signal_2
NetD6_16: D6.16(PA8) ; port BUTTON_RIGHT_LTV-817_OUT
NetD6_18: D6.18(PA11) ; port BUTTON_LEFT_LTV-817_OUT
NetD6_19: D6.19(PA12) ; port BUTTON_DUAL_LTV-817_OUT
NetD6_20: D6.20(PA13_SWDIO) X11.3
NetD6_21: D6.21(PA14-BOOT0_SWCLK) X11.2
NetD6_22: D6.22(PA15) ; port BUTTON_LIGHT_LTV-817_OUT

Not connected (* = marked no-connect by the designer): D6 1(PC14-OSC32_IN) 2(PC15-OSC32_OUT) 6(PA0) 7(PA1) 9(PA3) 17(PC6)

### Notes on the sheet
- SPI1_NSS
- GPIO_output
- SPI1_SCK
- SPI1_MISO
- SPI1_MOSI
- USART1_TX
- USART1_RX
- (near D6) DAC_OUT1
- (near D6) SPI1_MOSI
- +3.3V
- SWCLK
- (near D6) GPIO_output
- (near D6) TIM1_CH3
- SWDIO
- NRST
- (near D6) TIM3_CH2
- (near D6) Input
- GND
- Перв. примен.
- Справ. №
- Подп. и дата
- Инв. № дубл.
- Взам. инв. №
- Разраб.
- Изм.
- Лист
- № докум.
- Подп.
- Дата
- Лит.
- Масса
- Масштаб
- Пров.
- Т.контр.
- Листов
- Инв. № подл.
- Утв.
- Н.контр.
- 2.106-A3
- Копировал
- Формат А3
- (in symbol PLS-5) Цепь; Конт.

### Library data of the parts
C17 C18 = Ceramic_0603: as C15 on sheet Узел UART преобразователя; Package: 0603; HelpURL: https://www.digikey.com/product-detail/en/yageo/CC0603KRX7R7BB104/311-1088-1-ND/302998; Temperature: -55...+125°C
C19 = Ceramic_0603: as C1 on sheet Flash; Package: 0603; HelpURL: https://www.digikey.com/product-detail/en/yageo/CC0603KRX7R7BB104/311-1088-1-ND/302998; Temperature: -55...+125°C
D6 = STM32G071GBU6N: Cortex-M0; Manufacturer: STMicroelectronics; ValueManufacturerPartNumber: IC microcontroller, 32-Bit, Cortex-M0, 64 MHz, 128KB, 32KB, 2.4...3.6V, -40...+85°C, QFN-28; Supply: 2.4...3.6V; Speed: 64 MHz; CoreSize: 32-Bit; MemoryROM: 128KB; MemoryRAM: 32KB; HelpURL: https://belchip.by/product/?selected_product=37987; Package: QFN-28; ComponentType: IC microcontroller; Temperature: -40...+85°C; CoreProcessor: Cortex-M0; PartNumber: STM32G071GBU6N
R21 = Resistor_0603: as R5 on sheet Схема_узел_подключения светодиодной ленты; Package: 0603; HelpURL: https://www.digikey.com/product-detail/en/yageo/RC0603JR-07100RL/311-100GRCT-ND/729644; Temperature: -55...+125°C
SW1 = Button_3x4x2_SMT: SMT 3*4*2 2PIN; Manufacturer: xin cheng electronic; HelpURL: https://aliexpress.ru/item/32309509976.html?spm=a2g0v.12010612.8148356.51.441f61b1yUlL0Q; ValueManufacturerPartNumber: =TypeButton+', '+Package; PartNumber: 3*4*2 2PIN; Package: 3*4*2mm
X11 = PLS-5: Manufacturer: Connfly; ValueManufacturerPartNumber: Connector, 5pin, 2.54mm, 500VAC, 3A; TypeConnector: Connector; VoltageMax: 500VAC; Pitch: 2.54mm; CurrentMax: 3A; Multichannel: 5pin; HelpURL: https://www.chipdip.ru/product/pls-5; PartNumber: PLS-5

## Nets that join several sheets
+3.3: Flash (C1.1 D1.8), DC-DC_VCC_IN_+3V (C7.2 C8.1 D3.2 D3.4), Sheet1 (R9.2 R10.2 R13.2 R14.2), Микроконтроллер (5 pins)
+5: Схема_узел_подключения светодиодной ленты (X3.1), DC-DC_VCC_IN_+3V (6 pins)
+5USB: Узел UART преобразователя (6 pins), Узел разъёма usb (X9.1)
GND: Схема_узел_поворотников (R3.1 R4.1 VT1.2 VT2.2), Схема_узел_подключения светодиодной ленты (X3.3), Flash (C1.2 D1.4), DC-DC_VCC_IN_+3V (12 pins), Sheet1 (8 pins), Узел UART преобразователя (C15.1 C16.1 D5.0 D5.3), Узел разъёма usb (X9.0 X9.5), Узел входного разъёма питания (X10.2), Микроконтроллер (6 pins)
VCC: Схема_узел_поворотников (X1.1 X2.1), DC-DC_VCC_IN_+3V (C2.1 C3.2 D2.1 R6.2), Sheet1 (X4.1 X5.1 X6.1 X7.1), Узел входного разъёма питания (VD2.2)
NetD1_1: Flash (D1.1), Микроконтроллер (D6.14)
NetD1_2: Flash (D1.2), Микроконтроллер (D6.24)
NetD1_3: Flash (D1.3), Микроконтроллер (D6.15)
NetD1_5: Flash (D1.5), Микроконтроллер (D6.25)
NetD1_6: Flash (D1.6), Микроконтроллер (D6.23)
NetD1_7: Flash (D1.7), Микроконтроллер (D6.28)
NetD5_4: Узел UART преобразователя (D5.4), Узел разъёма usb (X9.3)
NetD5_5: Узел UART преобразователя (D5.5), Узел разъёма usb (X9.2)
NetD5_25: Узел UART преобразователя (D5.25), Микроконтроллер (D6.26)
NetD5_26: Узел UART преобразователя (D5.26), Микроконтроллер (D6.27)
NetD6_8: Схема_узел_подключения светодиодной ленты (R5.1), Микроконтроллер (D6.8)
NetD6_12: Схема_узел_поворотников (R1.1), Микроконтроллер (D6.12)
NetD6_13: Схема_узел_поворотников (R2.1), Микроконтроллер (D6.13)
NetD6_16: Sheet1 (R14.1 U4.4), Микроконтроллер (D6.16)
NetD6_18: Sheet1 (R13.1 U3.4), Микроконтроллер (D6.18)
NetD6_19: Sheet1 (R9.1 U1.4), Микроконтроллер (D6.19)
NetD6_22: Sheet1 (R10.1 U2.4), Микроконтроллер (D6.22)